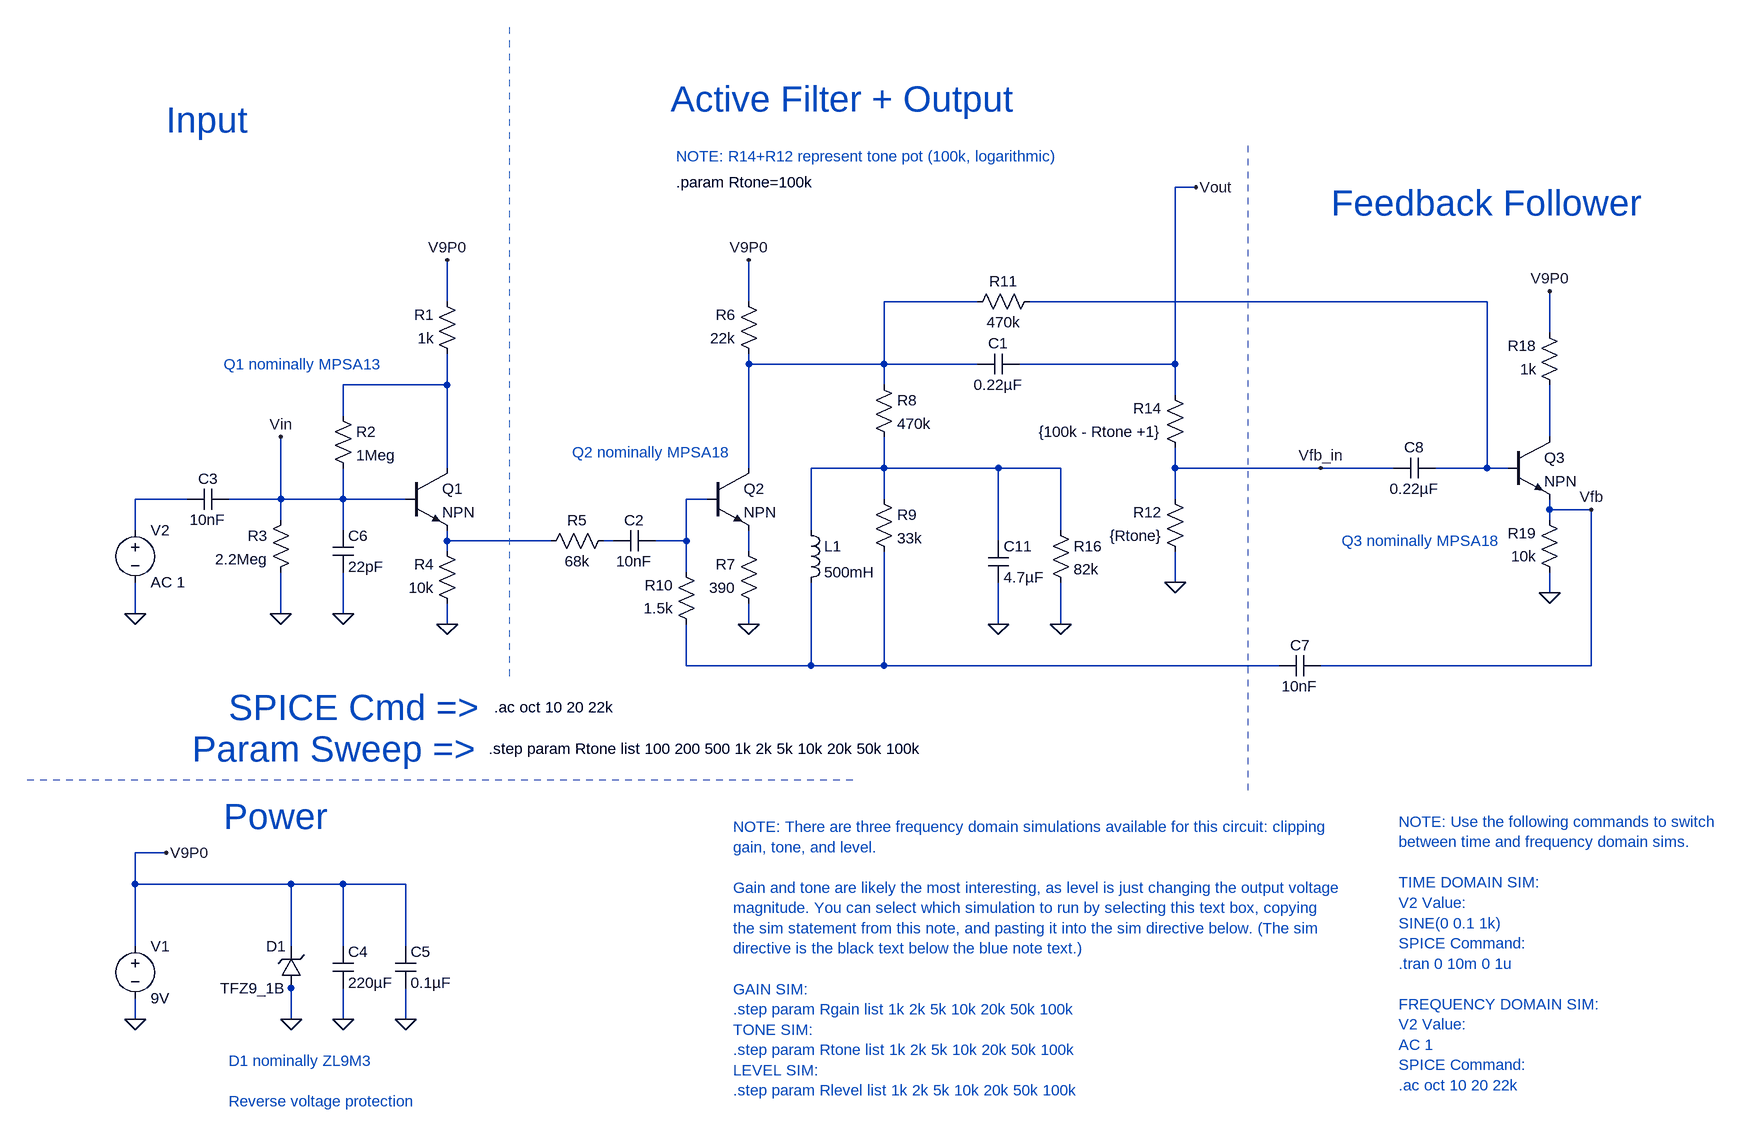
[diagram p0: schematic dunlop-crybaby-wah.asc]
dunlop-crybaby-wah.asc, the LTspice schematic file:
Version 4
SHEET 1 2340 1412
WIRE 1024 -288 992 -288
WIRE -128 -112 -128 -176
WIRE 336 -112 336 -176
WIRE 688 -112 544 -112
WIRE 1472 -112 768 -112
WIRE 1568 -64 1568 -128
WIRE 336 -16 336 -32
WIRE 544 -16 544 -112
WIRE 544 -16 336 -16
WIRE 688 -16 544 -16
WIRE 992 -16 992 -288
WIRE 992 -16 752 -16
WIRE -128 16 -128 -32
WIRE -128 16 -288 16
WIRE 544 16 544 -16
WIRE 992 32 992 -16
WIRE -288 64 -288 16
WIRE 1568 96 1568 16
WIRE -128 144 -128 16
WIRE 336 144 336 -16
WIRE 544 144 544 96
WIRE 544 144 432 144
WIRE 720 144 544 144
WIRE 816 144 720 144
WIRE 992 144 992 112
WIRE 1216 144 992 144
WIRE 1328 144 1216 144
WIRE 1472 144 1472 -112
WIRE 1472 144 1392 144
WIRE 1504 144 1472 144
WIRE -528 192 -608 192
WIRE -384 192 -384 96
WIRE -384 192 -464 192
WIRE -288 192 -288 144
WIRE -288 192 -384 192
WIRE -192 192 -288 192
WIRE 272 192 240 192
WIRE 544 192 544 144
WIRE 992 192 992 144
WIRE 1568 208 1568 192
WIRE 1632 208 1568 208
WIRE -384 224 -384 192
WIRE 1568 224 1568 208
WIRE -608 240 -608 192
WIRE -288 240 -288 192
WIRE 432 240 432 144
WIRE 816 240 816 144
WIRE -128 256 -128 240
WIRE 32 256 -128 256
WIRE 128 256 112 256
WIRE 240 256 240 192
WIRE 240 256 192 256
WIRE 720 256 720 144
WIRE -128 272 -128 256
WIRE 336 272 336 240
WIRE 240 304 240 256
WIRE 992 320 992 272
WIRE 1568 336 1568 304
WIRE -608 368 -608 320
WIRE -384 368 -384 304
WIRE -288 368 -288 304
WIRE -128 384 -128 352
WIRE 336 384 336 352
WIRE 720 384 720 320
WIRE 816 384 816 320
WIRE 240 448 240 384
WIRE 432 448 432 320
WIRE 432 448 240 448
WIRE 544 448 544 272
WIRE 544 448 432 448
WIRE 1152 448 544 448
WIRE 1632 448 1632 208
WIRE 1632 448 1216 448
WIRE -560 736 -608 736
WIRE -608 784 -608 736
WIRE -368 784 -608 784
WIRE -288 784 -368 784
WIRE -192 784 -288 784
WIRE -608 880 -608 784
WIRE -368 880 -368 784
WIRE -288 880 -288 784
WIRE -192 880 -192 784
WIRE -368 944 -368 928
WIRE -608 992 -608 960
WIRE -368 992 -368 944
WIRE -288 992 -288 944
WIRE -192 992 -192 944
FLAG -608 992 0
FLAG -384 368 0
FLAG -608 368 0
FLAG -288 992 0
FLAG -192 992 0
FLAG -560 736 V9P0
FLAG -368 992 0
FLAG 720 384 0
FLAG 992 320 0
FLAG -384 96 Vin
FLAG -288 368 0
FLAG -128 -176 V9P0
FLAG -128 384 0
FLAG 336 -176 V9P0
FLAG 336 384 0
FLAG 816 384 0
FLAG 1568 -128 V9P0
FLAG 1568 336 0
FLAG 1024 -288 Vout
FLAG 1632 208 Vfb
FLAG 1216 144 Vfb_in
SYMBOL voltage -608 864 R0
SYMATTR InstName V1
SYMATTR Value 9V
SYMBOL cap 192 240 R90
WINDOW 0 0 32 VBottom 2
WINDOW 3 32 32 VTop 2
SYMATTR InstName C2
SYMATTR Value 10nF
SYMBOL res -112 -16 R180
WINDOW 0 36 76 Left 2
WINDOW 3 36 40 Left 2
SYMATTR InstName R1
SYMATTR Value 1k
SYMBOL cap -464 176 R90
WINDOW 0 0 32 VBottom 2
WINDOW 3 32 32 VTop 2
SYMATTR InstName C3
SYMATTR Value 10nF
SYMBOL res -304 48 R0
SYMATTR InstName R2
SYMATTR Value 1Meg
SYMBOL res -368 208 M0
SYMATTR InstName R3
SYMATTR Value 2.2Meg
SYMBOL voltage -608 224 R0
WINDOW 123 24 124 Left 2
WINDOW 39 0 0 Left 0
SYMATTR InstName V2
SYMATTR Value AC 1
SYMBOL cap -304 880 R0
SYMATTR InstName C4
SYMATTR Value 220µF
SYMBOL cap -208 880 R0
SYMATTR InstName C5
SYMATTR Value 0.1µF
SYMBOL zener -352 944 R180
WINDOW 0 24 64 Left 2
WINDOW 3 24 0 Left 2
SYMATTR InstName D1
SYMATTR Value TFZ9_1B
SYMATTR Description Diode
SYMATTR Type diode
SYMBOL res 256 400 R180
WINDOW 0 36 76 Left 2
WINDOW 3 36 40 Left 2
SYMATTR InstName R10
SYMATTR Value 1.5k
SYMBOL cap 704 256 R0
SYMATTR InstName C11
SYMATTR Value 4.7µF
SYMBOL res 1008 128 R180
WINDOW 0 36 76 Left 2
WINDOW 3 36 40 Left 2
SYMATTR InstName R14
SYMATTR Value {100k - Rtone +1}
SYMBOL cap -304 240 R0
SYMATTR InstName C6
SYMATTR Value 22pF
SYMBOL npn -192 144 R0
SYMATTR InstName Q1
SYMBOL res -112 368 R180
WINDOW 0 36 76 Left 2
WINDOW 3 36 40 Left 2
SYMATTR InstName R4
SYMATTR Value 10k
SYMBOL res 16 272 R270
WINDOW 0 32 56 VTop 2
WINDOW 3 0 56 VBottom 2
SYMATTR InstName R5
SYMATTR Value 68k
SYMBOL res 352 -16 R180
WINDOW 0 36 76 Left 2
WINDOW 3 36 40 Left 2
SYMATTR InstName R6
SYMATTR Value 22k
SYMBOL npn 272 144 R0
SYMATTR InstName Q2
SYMBOL res 352 368 R180
WINDOW 0 36 76 Left 2
WINDOW 3 36 40 Left 2
SYMATTR InstName R7
SYMATTR Value 390
SYMBOL res 528 0 R0
SYMATTR InstName R8
SYMATTR Value 470k
SYMBOL res 528 176 R0
SYMATTR InstName R9
SYMATTR Value 33k
SYMBOL ind 416 224 R0
SYMATTR InstName L1
SYMATTR Value 500mH
SYMBOL res 784 -128 R90
WINDOW 0 0 56 VBottom 2
WINDOW 3 32 56 VTop 2
SYMATTR InstName R11
SYMATTR Value 470k
SYMBOL cap 752 -32 R90
WINDOW 0 0 32 VBottom 2
WINDOW 3 32 32 VTop 2
SYMATTR InstName C1
SYMATTR Value 0.22µF
SYMBOL res 800 224 R0
SYMATTR InstName R16
SYMATTR Value 82k
SYMBOL res 1584 32 R180
WINDOW 0 36 76 Left 2
WINDOW 3 36 40 Left 2
SYMATTR InstName R18
SYMATTR Value 1k
SYMBOL npn 1504 96 R0
SYMATTR InstName Q3
SYMBOL res 1584 320 R180
WINDOW 0 36 76 Left 2
WINDOW 3 36 40 Left 2
SYMATTR InstName R19
SYMATTR Value 10k
SYMBOL cap 1216 432 R90
WINDOW 0 0 32 VBottom 2
WINDOW 3 32 32 VTop 2
SYMATTR InstName C7
SYMATTR Value 10nF
SYMBOL res 1008 288 R180
WINDOW 0 36 76 Left 2
WINDOW 3 36 40 Left 2
SYMATTR InstName R12
SYMATTR Value {Rtone}
SYMBOL cap 1392 128 R90
WINDOW 0 0 32 VBottom 2
WINDOW 3 32 32 VTop 2
SYMATTR InstName C8
SYMATTR Value 0.22µF
TEXT -560 -392 Left 5 ;Input
TEXT 216 -424 Left 5 ;Active Filter + Output
TEXT 1232 -264 Left 5 ;Feedback Follower
TEXT -472 680 Left 5 ;Power
TEXT -464 1056 Left 2 ;D1 nominally ZL9M3\n \nReverse voltage protection
TEXT 312 696 Left 2 ;NOTE: There are three frequency domain simulations available for this circuit: clipping \ngain, tone, and level.\n \nGain and tone are likely the most interesting, as level is just changing the output voltage \nmagnitude. You can select which simulation to run by selecting this text box, copying \nthe sim statement from this note, and pasting it into the sim directive below. (The sim \ndirective is the black text below the blue note text.)\n \nGAIN SIM:\n.step param Rgain list 1k 2k 5k 10k 20k 50k 100k\nTONE SIM:\n.step param Rtone list 1k 2k 5k 10k 20k 50k 100k\nLEVEL SIM:\n.step param Rlevel list 1k 2k 5k 10k 20k 50k 100k
TEXT 224 -336 Left 2 ;NOTE: R14+R12 represent tone pot (100k, logarithmic)
TEXT -64 576 Left 2 !.step param Rtone list 100 200 500 1k 2k 5k 10k 20k 50k 100k
TEXT -56 512 Left 2 !.ac oct 10 20 22k
TEXT 224 -296 Left 2 !.param Rtone=100k
TEXT -464 512 Left 5 ;SPICE Cmd =>
TEXT -520 576 Left 5 ;Param Sweep =>
TEXT 1336 688 Left 2 ;NOTE: Use the following commands to switch \nbetween time and frequency domain sims.\n \nTIME DOMAIN SIM:\nV2 Value: \nSINE(0 0.1 1k)\nSPICE Command: \n.tran 0 10m 0 1u\n \nFREQUENCY DOMAIN SIM:\nV2 Value: \nAC 1\nSPICE Command:\n.ac oct 10 20 22k
TEXT -472 -16 Left 2 ;Q1 nominally MPSA13
TEXT 64 120 Left 2 ;Q2 nominally MPSA18
TEXT 1248 256 Left 2 ;Q3 nominally MPSA18
LINE Normal -32 464 -32 -544 2
LINE Normal 1104 640 1104 -352 2
LINE Normal 496 624 -784 624 2

The netlist it stands for:
* dunlop-crybaby-wah.asc
V1 V9P0 0 9V
C2 N007 N009 10nF
R1 N003 V9P0 1k
C3 Vin N006 10nF
R2 N003 Vin 1Meg
R3 Vin 0 2.2Meg
V2 N006 0 AC 1
C4 V9P0 0 220µF
C5 V9P0 0 0.1µF
D1 0 V9P0 TFZ9_1B
R10 N011 N007 1.5k
C11 N005 0 4.7µF
R14 Vfb_in Vout {100k - Rtone +1}
C6 Vin 0 22pF
Q1 N003 Vin N008 0 NPN
R4 0 N008 10k
R5 N008 N009 68k
R6 N001 V9P0 22k
Q2 N001 N007 N010 0 NPN
R7 0 N010 390
R8 N001 N005 470k
R9 N005 N011 33k
L1 N005 N011 500mH
R11 N002 N001 470k
C1 Vout N001 0.22µF
R16 N005 0 82k
R18 N004 V9P0 1k
Q3 N004 N002 Vfb 0 NPN
R19 0 Vfb 10k
C7 Vfb N011 10nF
R12 0 Vfb_in {Rtone}
C8 N002 Vfb_in 0.22µF
.model D D
.lib standard.dio
.model NPN NPN
.model PNP PNP
.lib standard.bjt
* Input
* Active Filter + Output
* Feedback Follower
* Power
* D1 nominally ZL9M3
* Reverse voltage protection
* NOTE: There are three frequency domain simulations available for this circuit: clipping
* gain, tone, and level.
* Gain and tone are likely the most interesting, as level is just changing the output voltage
* magnitude. You can select which simulation to run by selecting this text box, copying
* the sim statement from this note, and pasting it into the sim directive below. (The sim
* directive is the black text below the blue note text.)
* GAIN SIM:
* .step param Rgain list 1k 2k 5k 10k 20k 50k 100k
* TONE SIM:
* .step param Rtone list 1k 2k 5k 10k 20k 50k 100k
* LEVEL SIM:
* .step param Rlevel list 1k 2k 5k 10k 20k 50k 100k
* NOTE: R14+R12 represent tone pot (100k, logarithmic)
.step param Rtone list 100 200 500 1k 2k 5k 10k 20k 50k 100k
.ac oct 10 20 22k
.param Rtone=100k
* SPICE Cmd =>
* Param Sweep =>
* NOTE: Use the following commands to switch
* between time and frequency domain sims.
* TIME DOMAIN SIM:
* V2 Value:
* SINE(0 0.1 1k)
* SPICE Command:
* .tran 0 10m 0 1u
* FREQUENCY DOMAIN SIM:
* V2 Value:
* AC 1
* SPICE Command:
* .ac oct 10 20 22k
* Q1 nominally MPSA13
* Q2 nominally MPSA18
* Q3 nominally MPSA18
.backanno
.end